# EAGLE schematic Arduino_ultrasonic_bjt (EAGLE 7.4.0)
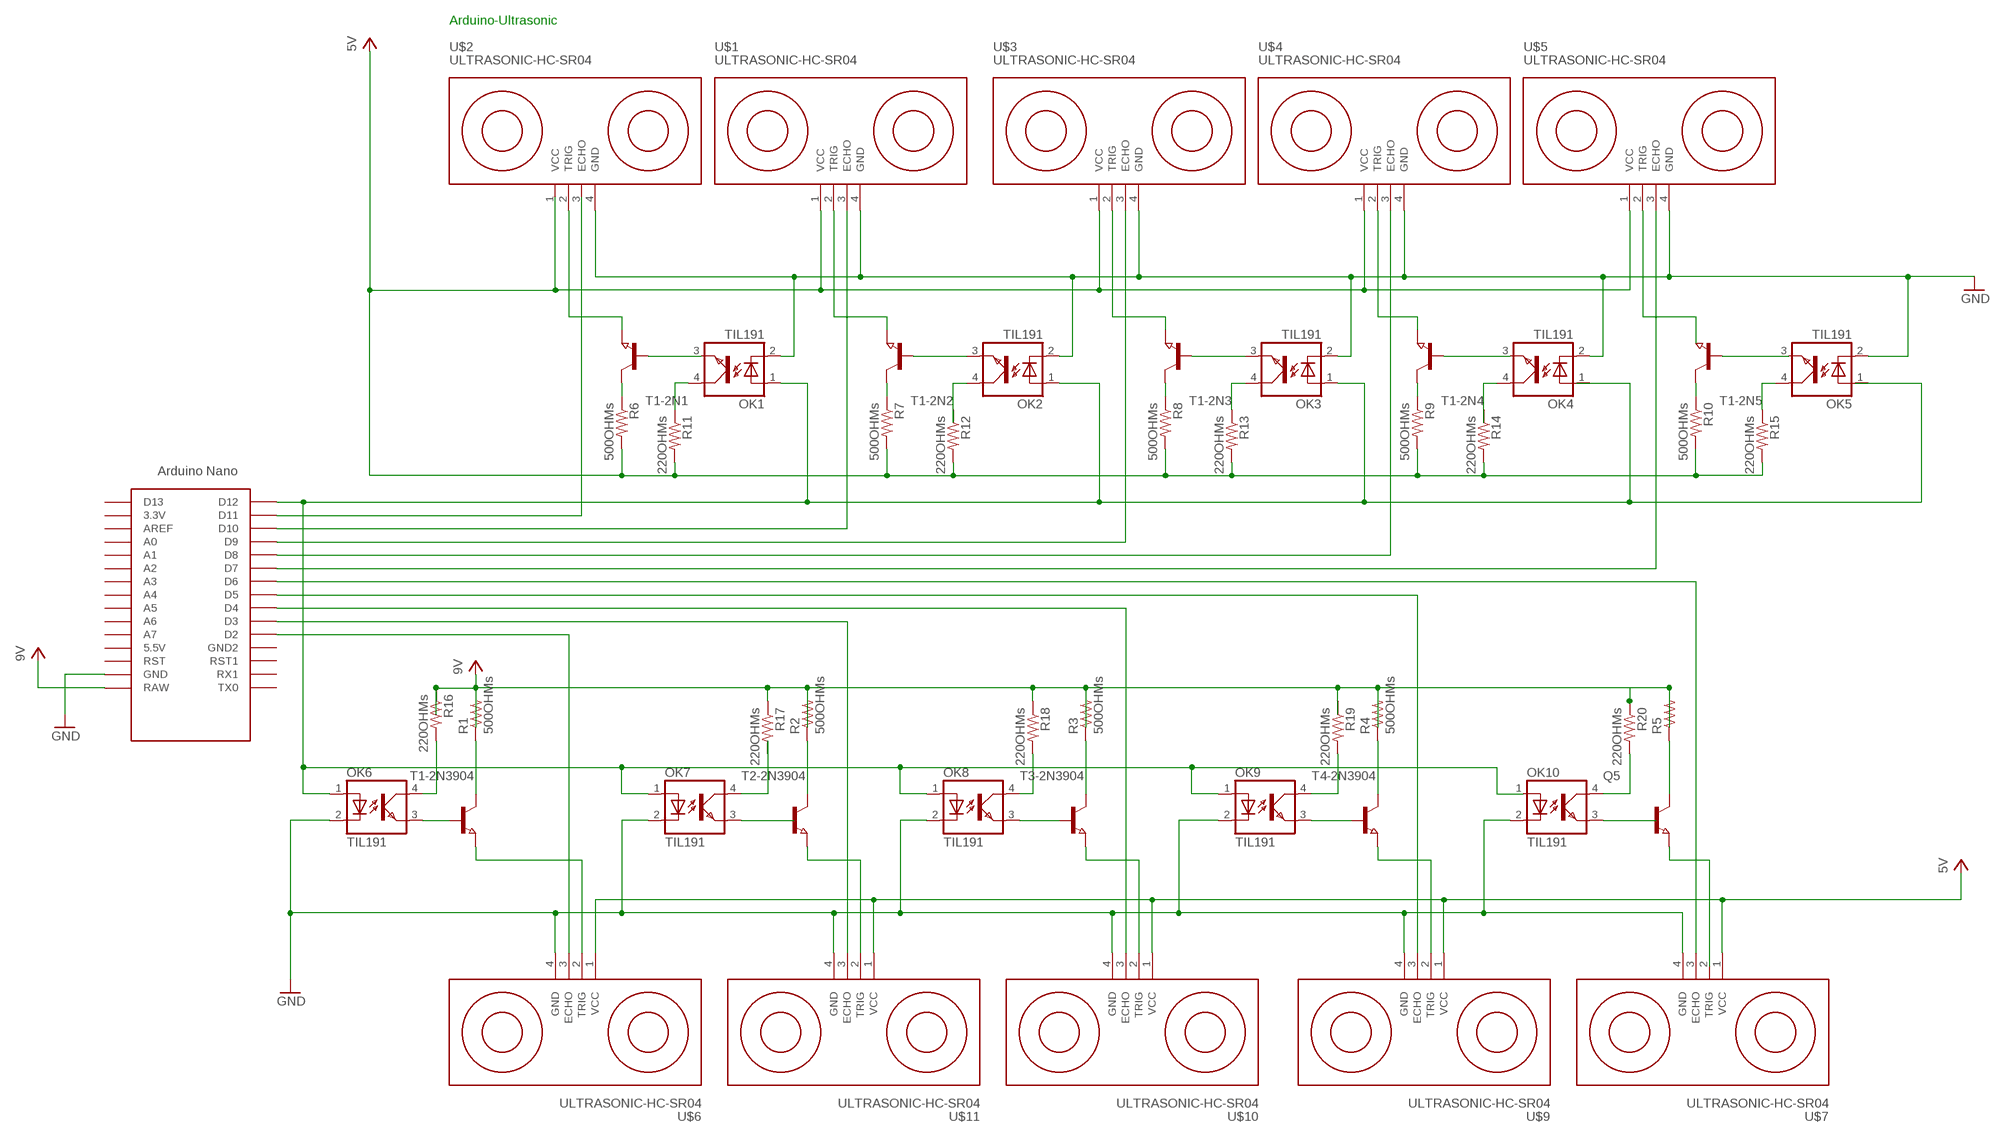
[diagram p0: schematic, sheet 1]

## Parts
OK1  TIL191  [DIL04]
OK2  TIL191  [DIL04]
OK3  TIL191  [DIL04]
OK4  TIL191  [DIL04]
OK5  TIL191  [DIL04]
OK6  TIL191  [DIL04]
OK7  TIL191  [DIL04]
OK8  TIL191  [DIL04]
OK9  TIL191  [DIL04]
OK10  TIL191  [DIL04]
Q5  NPN-TRANSISTOR_SOT23  [SOT23]
R1  500OHMs  R-US_0204/2V  [0204V]
R2  500OHMs  R-US_0204/2V  [0204V]
R3  500OHMs  R-US_0204/2V  [0204V]
R4  500OHMs  R-US_0204/2V  [0204V]
R5  R-US_0204/2V  [0204V]
R6  500OHMs  R-US_0204/2V  [0204V]
R7  500OHMs  R-US_0204/2V  [0204V]
R8  500OHMs  R-US_0204/2V  [0204V]
R9  500OHMs  R-US_0204/2V  [0204V]
R10  500OHMs  R-US_0204/2V  [0204V]
R11  220OHMs  R-US_0204/2V  [0204V]
R12  220OHMs  R-US_0204/2V  [0204V]
R13  220OHMs  R-US_0204/2V  [0204V]
R14  220OHMs  R-US_0204/2V  [0204V]
R15  220OHMs  R-US_0204/2V  [0204V]
R16  220OHMs  R-US_0204/2V  [0204V]
R17  220OHMs  R-US_0204/2V  [0204V]
R18  220OHMs  R-US_0204/2V  [0204V]
R19  220OHMs  R-US_0204/2V  [0204V]
R20  220OHMs  R-US_0204/2V  [0204V]
T1-2N1  NPN-TRANSISTOR_SOT23  [SOT23]
T1-2N2  NPN-TRANSISTOR_SOT23  [SOT23]
T1-2N3  NPN-TRANSISTOR_SOT23  [SOT23]
T1-2N4  NPN-TRANSISTOR_SOT23  [SOT23]
T1-2N5  NPN-TRANSISTOR_SOT23  [SOT23]
T1-2N3904  NPN-TRANSISTOR_SOT23  [SOT23]
T2-2N3904  NPN-TRANSISTOR_SOT23  [SOT23]
T3-2N3904  NPN-TRANSISTOR_SOT23  [SOT23]
T4-2N3904  NPN-TRANSISTOR_SOT23  [SOT23]
U$1  ULTRASONIC-HC-SR04  [ULTRASONIC-HC-SR04]
U$2  ULTRASONIC-HC-SR04  [ULTRASONIC-HC-SR04]
U$3  ULTRASONIC-HC-SR04  [ULTRASONIC-HC-SR04]
U$4  ULTRASONIC-HC-SR04  [ULTRASONIC-HC-SR04]
U$5  ULTRASONIC-HC-SR04  [ULTRASONIC-HC-SR04]
U$6  ULTRASONIC-HC-SR04  [ULTRASONIC-HC-SR04]
U$7  ULTRASONIC-HC-SR04  [ULTRASONIC-HC-SR04]
U$9  ULTRASONIC-HC-SR04  [ULTRASONIC-HC-SR04]
U$10  ULTRASONIC-HC-SR04  [ULTRASONIC-HC-SR04]
U$11  ULTRASONIC-HC-SR04  [ULTRASONIC-HC-SR04]
U$12  NANO  [NANO]

## Nets
GND: OK1.2(C) OK2.2(C) OK3.2(C) OK4.2(C) OK5.2(C) OK6.2(C) OK7.2(C) OK8.2(C) OK9.2(C) OK10.2(C) U$1.4(GND) U$2.4(GND) U$3.4(GND) U$4.4(GND) U$5.4(GND) U$6.4(GND) U$7.4(GND) U$9.4(GND) U$10.4(GND) U$11.4(GND) U$12.GND
N$1: R6.1 T1-2N1.3(C)
N$2: U$6.3(ECHO) U$12.D2
N$3: U$11.3(ECHO) U$12.D3
N$4: U$10.3(ECHO) U$12.D4
N$5: U$9.3(ECHO) U$12.D5
N$6: U$7.3(ECHO) U$12.D6
N$7: U$5.3(ECHO) U$12.D7
N$8: U$4.3(ECHO) U$12.D8
N$9: U$3.3(ECHO) U$12.D9
N$10: U$1.3(ECHO) U$12.D10
N$11: U$2.3(ECHO) U$12.D11
N$12: OK1.1(A) OK2.1(A) OK3.1(A) OK6.1(A) OK7.1(A) OK8.1(A) OK9.1(A) U$12.D12
N$13: R2.1 T2-2N3904.3(C)
N$14: R3.1 T3-2N3904.3(C)
N$15: R4.1 T4-2N3904.3(C)
N$16: Q5.3(C) R5.1
N$17: T1-2N3904.2(E) U$6.2(TRIG)
N$18: T2-2N3904.2(E) U$11.2(TRIG)
N$19: T3-2N3904.2(E) U$10.2(TRIG)
N$20: T4-2N3904.2(E) U$9.2(TRIG)
N$21: Q5.2(E)
N$22: R7.1 T1-2N2.3(C)
N$23: R8.1 T1-2N3.3(C)
N$24: R9.1 T1-2N4.3(C)
N$25: R10.1 T1-2N5.3(C)
N$26: T1-2N1.2(E) U$2.2(TRIG)
N$27: T1-2N2.2(E) U$1.2(TRIG)
N$28: T1-2N3.2(E) U$3.2(TRIG)
N$29: T1-2N4.2(E) U$4.2(TRIG)
N$30: U$5.2(TRIG)
N$31: R1.1 T1-2N3904.3(C)
N$32: OK5.4(COL) R15.1
N$33: OK4.4(COL)
N$34: OK3.4(COL) R13.1
N$35: OK2.4(COL)
N$36: OK1.4(COL) R11.1
N$37: T1-2N1.1(B)
N$38: OK2.3(EMIT) T1-2N2.1(B)
N$39: OK3.3(EMIT) T1-2N3.1(B)
N$40: T1-2N4.1(B)
N$41: T1-2N5.1(B)
N$42: OK7.3(EMIT)
N$43: OK7.4(COL)
N$44: OK6.4(COL) R16.2
N$45: OK6.3(EMIT) T1-2N3904.1(B)
N$46: OK8.4(COL) R18.2
N$47: OK8.3(EMIT) T3-2N3904.1(B)
N$48: OK9.4(COL) R19.2
N$49: OK9.3(EMIT) T4-2N3904.1(B)
N$50: OK10.4(COL) R20.2
N$51: OK10.3(EMIT)
VCC: R1.2 R2.2 R3.2 R4.2 R5.2 R6.2 R7.2 R8.2 R9.2 R10.2 R11.2 R12.2 R13.2 R14.2 R15.2 R16.1 R17.1 R18.1 R20.1 U$1.1(VCC) U$2.1(VCC) U$3.1(VCC) U$4.1(VCC) U$5.1(VCC) U$6.1(VCC) U$7.1(VCC) U$9.1(VCC) U$10.1(VCC) U$11.1(VCC) U$12.RAW ; supply symbol labelled 9V, 5V
Unconnected: OK1.3(EMIT) OK4.1(A) OK4.3(EMIT) OK5.1(A) OK5.3(EMIT) OK10.1(A) Q5.1(B) R12.1 R14.1 R17.2 R19.1 T1-2N5.2(E) T2-2N3904.1(B) U$7.2(TRIG) U$12.3.3V U$12.5V(5.5V) U$12.A0 U$12.A1 U$12.A2 U$12.A3 U$12.A4 U$12.A5 U$12.A6 U$12.A7 U$12.AREF U$12.D13 U$12.GND1(GND2) U$12.ICSP1 U$12.ICSP2 U$12.ICSP3 U$12.ICSP4 U$12.ICSP5 U$12.ICSP6 U$12.RST U$12.RST1 U$12.RX1 U$12.TX0

## Notes on the sheet
- Arduino-Ultrasonic

## Library data of the parts
OK1-OK10 = optocoupler:TIL191: TEXAS INSTRUMENTS OPTO COUPLER; OC_FARNELL: 1683363; OC_NEWARK: unknown
Q5 T1-2N1-T1-2N5 T1-2N3904 T2-2N3904 T3-2N3904 T4-2N3904 = semicon-smd-ipc:NPN-TRANSISTOR_: NPN TRANSISTOR
R1-R20 = rcl:R-US_: RESISTOR, American symbol
U$1-U$7 U$9-U$11 = diy-modules:ULTRASONIC-HC-SR04: Ultrasonic Ranging Module HC-SR04 More details available here: http://randomnerdtutorials.com/complete-guide-for-ultrasonic-sensor-hc-sr04/ Click here to find device on ebay.com <http://www.ebay.com/sch/hc+sr04+ultrasonic>
U$12 = Arduino-clone:NANO: Arduino Nano